# EAGLE schematic Supplemental Power Switch System (EAGLE 8.0.1)
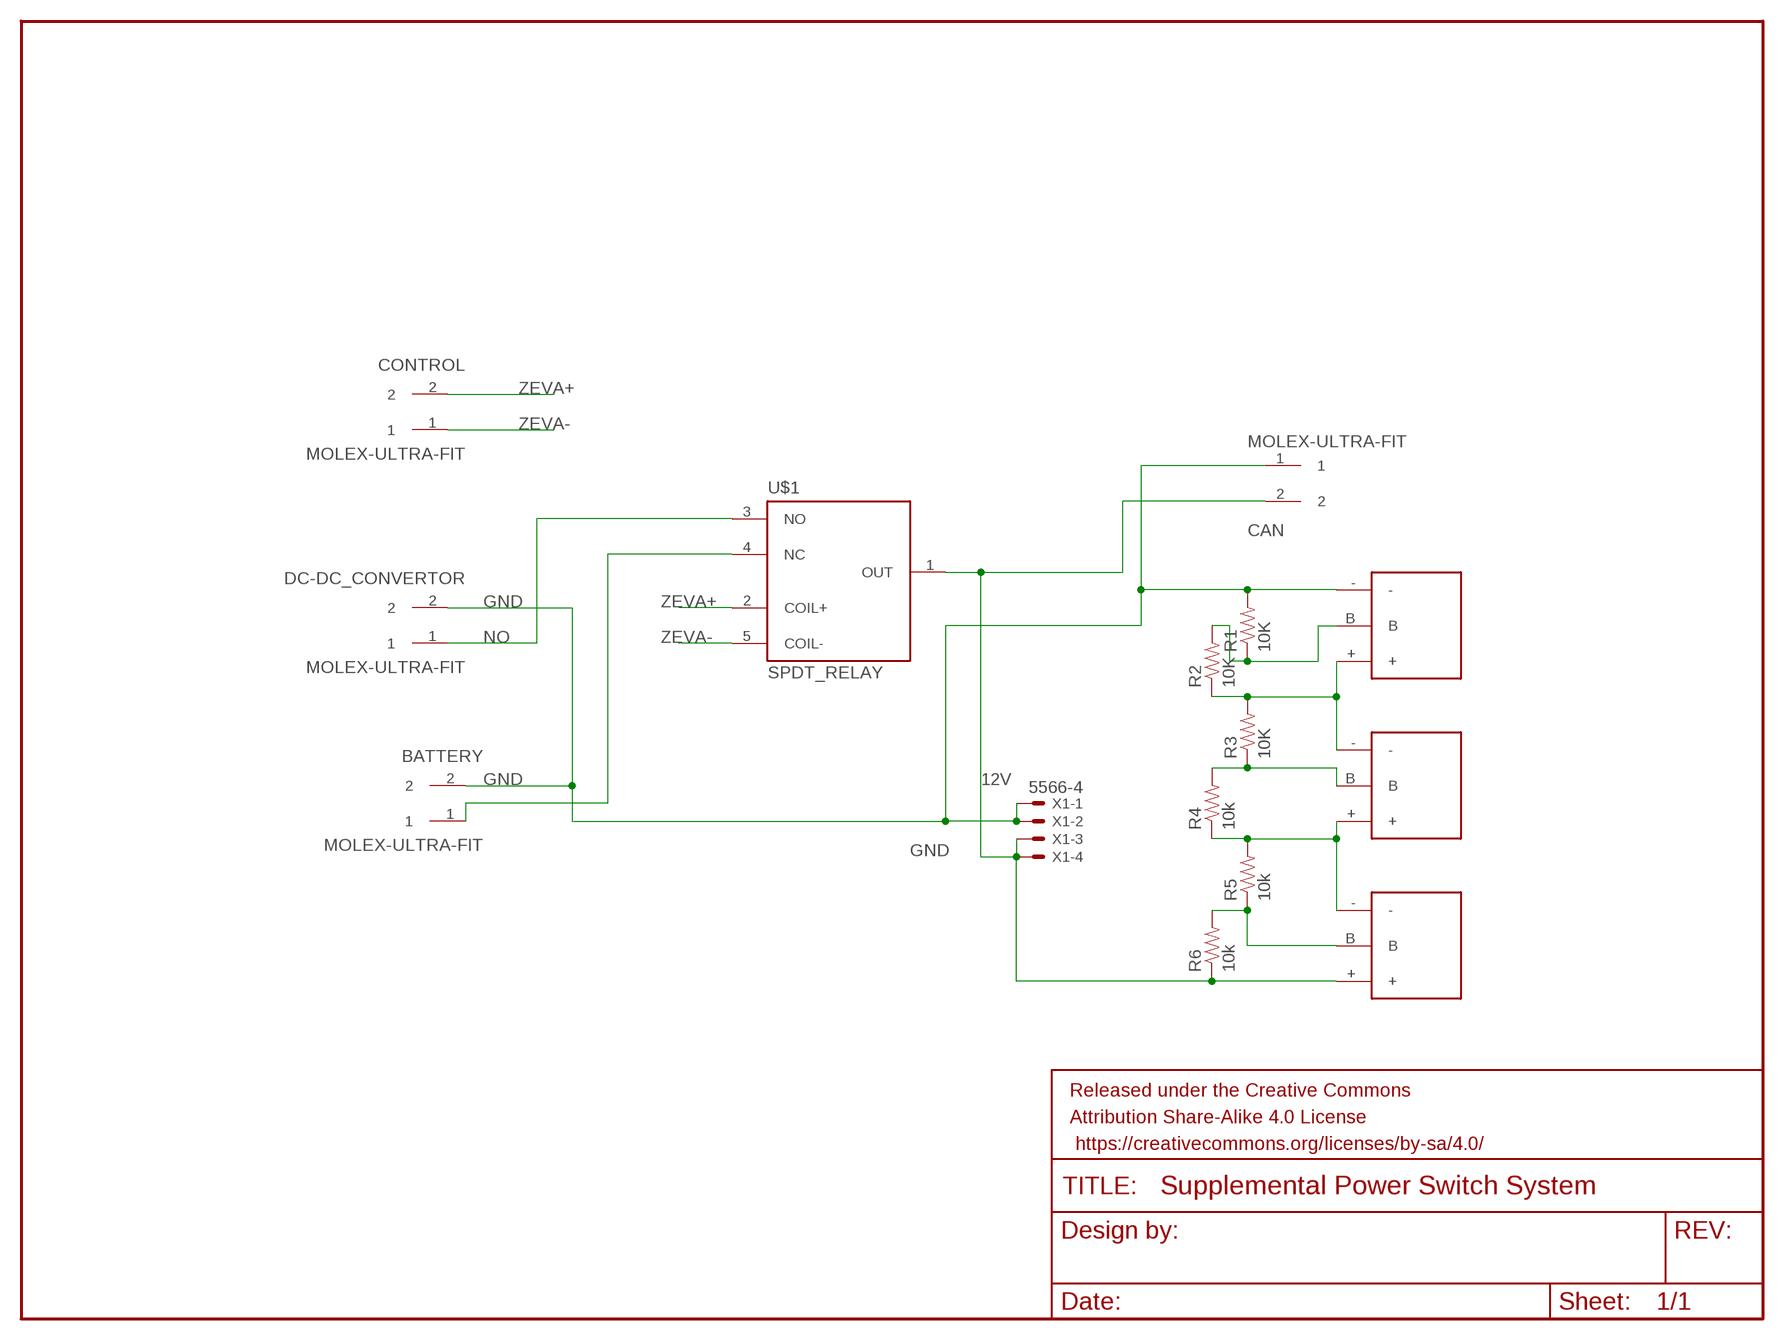
[diagram p0: schematic, sheet 1]

## Parts
BATTERY  MOLEX-ULTRA-FIT  [MOLEX-172287]
C1  SUPER-CAPACITOR  [DMF]
C2  SUPER-CAPACITOR  [DMF]
C3  SUPER-CAPACITOR  [DMF]
CAN  MOLEX-ULTRA-FIT  [MOLEX-172287]
CONTROL  MOLEX-ULTRA-FIT  [MOLEX-172287]
DC-DC_CONVERTOR  MOLEX-ULTRA-FIT  [MOLEX-172287]
FRAME1  FRAME-LETTERNO_PACKAGE  [DUMMY]
R1  10K  RESISTOR1206  [1206]
R2  10K  RESISTOR1206  [1206]
R3  10K  RESISTOR1206  [1206]
R4  10k  RESISTOR1206  [1206]
R5  10k  RESISTOR1206  [1206]
R6  10k  RESISTOR1206  [1206]
U$1  SPDT_RELAY  [G8QN-1C4]
X1  5566-4  [5566-4]

## Nets
12V: C3.+ CAN.2 R6.1 U$1.1(OUT) X1.3 X1.4
GND: BATTERY.2 C1.- CAN.1 DC-DC_CONVERTOR.2 R1.2 X1.1 X1.2
N$3: C3.B R5.1 R6.2
N$4: C2.+ C3.- R4.1 R5.2
N$5: C2.B R3.1 R4.2
N$6: C1.+ C2.- R2.1 R3.2
N$7: C1.B R1.1 R2.2
NC: BATTERY.1 U$1.4(NC)
NO: DC-DC_CONVERTOR.1 U$1.3(NO)
ZEVA+: CONTROL.2 U$1.2(COIL+)
ZEVA-: CONTROL.1 U$1.5(COIL-)

## Library data of the parts
BATTERY CAN CONTROL DC-DC_CONVERTOR = Hooman:MOLEX-ULTRA-FIT: molex ultrafit 3.5 mm pitch 2 pin connector header
C1-C3 = Hooman:SUPER-CAPACITOR: Murata Super Capacitor DMF3Z5R5H474M3DTA0
FRAME1 = SparkFun-Aesthetics:FRAME-LETTER: Schematic Frame Standard 8.5x11 US Letter frame; DESIGNER: Nobody; VERSION: v01
R1-R6 = SparkFun-Passives:RESISTOR: Resistor Basic schematic elements and footprints for 0603, 1206, and PTH resistors.
U$1 = Hooman:SPDT_RELAY: SPDT Relay
X1 = con-molex:5566-4: Mini FIT connector 4 pol Source: http://www.molex.com; OC_FARNELL: unknown; OC_NEWARK: unknown